# Altium project UART Converter use MCP2200.PrjPcb
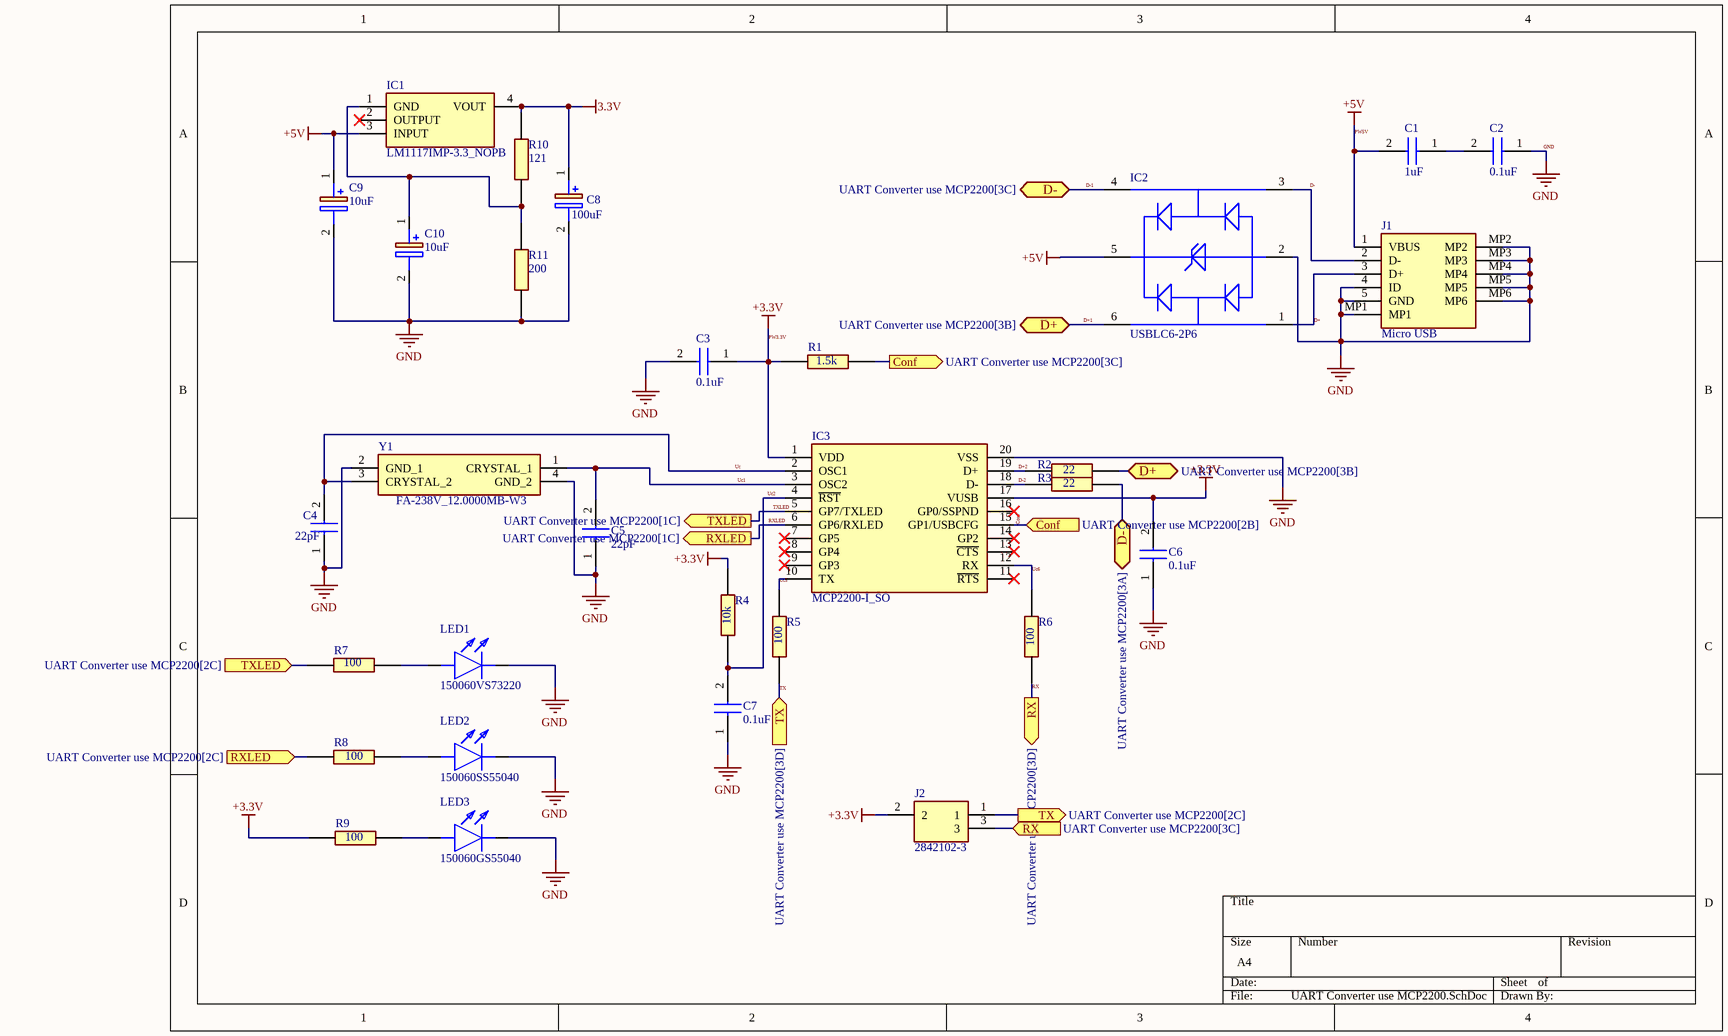
[diagram p0: UART Converter use MCP2200.SchDoc]
1 sheet, 30 parts. Net scope: flat (ports and power ports of the same name join across sheets).
Board file: UART Converter use MCP2200.PcbDoc

## Sheet UART Converter use MCP2200.SchDoc: UART Converter use MCP2200
size A4; ApprovedBy: Ing.IsmelArab; CheckedBy: Ing.IsmelArab; Author: Ing.IsmelArab; CompanyName: InGnia; Engineer: IsmelArab; Revision: Rev1.0; SheetNumber: 1; SheetTotal: 1

### Parts
C1  1uF  [CAPC3216X100N]
C2  0.1uF  [CAPC3216X100N]
C3  0.1uF  [CAPC3216X100N]
C4  22pF  [CAPC3216X100N]
C5  22pF  [CAPC3216X100N]
C6  0.1uF  [CAPC3216X100N]
C7  0.1uF  [CAPC3216X100N]
C8  100uF  [EEE1AA220WR]
C9  10uF  [EEE1AA220WR]
C10  10uF  [EEE1AA220WR]
IC1  LM1117IMP-3.3_NOPB  [SOT229P700X180-4N]
IC2  USBLC6-2P6  [USBLC62P6]
IC3  MCP2200-I_SO  [SOIC127P1030X265-20N]
J1  Micro USB  [0473461001]
J2  2842102-3  [28421023]
LED1  150060VS73220  [150060SS55040]
LED2  150060SS55040  [LEDC1608X50N]
LED3  150060GS55040  [LEDC1608X50N]
R1  1.5k  [RESC1608X55N]
R2  22  [RESC1608X55N]
R3  22  [RESC1608X55N]
R4  10k  [RESC1608X55N]
R5  100  [RESC1608X55N]
R6  100  [RESC1608X55N]
R7  100  [RESC1608X55N]
R8  100  [RESC1608X55N]
R9  100  [RESC1608X55N]
R10  121  [RESC1608X55N]
R11  200  [RESC1608X55N]
Y1  FA-238V_12.0000MB-W3  [FA-238V]

### Ports
Conf (in, see UART Converter use MCP2200[2B]), Conf (out, see UART Converter use MCP2200[3C]), D+ (bidir, see UART Converter use MCP2200[3B]), D- (bidir, see UART Converter use MCP2200[3A]), D- (bidir, see UART Converter use MCP2200[3C]), RX (in, see UART Converter use MCP2200[3C]), RX (out, see UART Converter use MCP2200[3D]), RXLED (in, see UART Converter use MCP2200[2C]), RXLED (out, see UART Converter use MCP2200[1C]), TX (in, see UART Converter use MCP2200[3D]), TX (out, see UART Converter use MCP2200[2C]), TXLED (in, see UART Converter use MCP2200[2C]), TXLED (out, see UART Converter use MCP2200[1C])

### Nets
3.3V: C8.1(+) IC1.4(VOUT) R10.1
GND: C2.1 C3.2 C4.1 C5.1 C6.1 C7.1 C8.2(-) C9.2(-) C10.2(-) IC2.2(GND) IC3.20(VSS) J1.4(ID) J1.5(GND) J1.MP1 J1.MP2 J1.MP3 J1.MP4 J1.MP5 J1.MP6 LED1.1(K) LED2.1(K) LED3.1(K) R11.2 Y1.2(GND_1) Y1.4(GND_2)
PW3.3V: C3.1 C6.2 IC3.1(VDD) IC3.17(VUSB) J2.2 R1.2 R4.2 R9.1  [also labelled +3.3V]
PW5V: C1.2 C9.1(+) IC1.3(INPUT) IC2.5(VBUS) J1.1(VBUS)  [also labelled +5V]
Conf: IC3.15(GP1/USBCFG) R1.1 ; port Conf
D+: IC2.1(I/O1_1) J1.3(D+)
D+1: IC2.6(I/O1_2) R2.1 ; port D+
D+2: IC3.19(D+) R2.2
D-: IC2.3(I/O2_1) J1.2(D-)
D-1: IC2.4(I/O2_2) R3.1 ; port D-
D-2: IC3.18(D-) R3.2
RX: J2.3 R6.1 ; port RX
RXLED: IC3.6(GP6/RXLED) R8.1 ; port RXLED
TX: J2.1 R5.1 ; port TX
TXLED: IC3.5(GP7/TXLED) R7.1 ; port TXLED
Uc: C4.2 IC3.2(OSC1) Y1.3(CRYSTAL_2)
Uc1: C5.2 IC3.3(OSC2) Y1.1(CRYSTAL_1)
Uc2: C7.2 IC3.4(~{RST}) R4.1
Uc5: IC3.10(TX) R5.2
Uc6: IC3.12(RX) R6.2
NetC1_1: C1.1 C2.2
NetC10_1: C10.1(+) IC1.1(GND) R10.2 R11.1
NetLED1_2: LED1.2(A) R7.2
NetLED2_2: LED2.2(A) R8.2
NetLED3_2: LED3.2(A) R9.2

Not connected (* = marked no-connect by the designer): IC1 2(OUTPUT)*; IC3 7(GP5)* 8(GP4)* 9(GP3)* 11(~{RTS})* 13(~{CTS})* 14(GP2)* 16(GP0/SSPND)*

### Library data of the parts
C1-C7 = CL31C220JBCNNNC: Capacitor; Manufacturer_Name: SAMSUNG; Datasheet Link: http://product.samsungsem.com/mlcc/CL31C220JBCNNN.do; Height: 1mm; Manufacturer_Part_Number: CL31C220JBCNNNC; Mouser Part Number: 187-CL31C220JBCNNNC; Mouser Price/Stock: https://www.mouser.co.uk/ProductDetail/Samsung-Electro-Mechanics/CL31C220JBCNNNC?qs=349EhDEZ59op%2FLhphPFLcA%3D%3D; Arrow Part Number: CL31C220JBCNNNC; Arrow Price/Stock: https://www.arrow.com/en/products/cl31c220jbcnnnc/samsung-electro-mechanics?region=nac
C8-C10 = EEE1AA100NR: Capacitor Polarised; Manufacturer_Name: Panasonic; Datasheet Link: http://industrial.panasonic.com/cdbs/www-data/pdf/RDE0000/ABA0000C1145.pdf; Height: 5.5mm; Manufacturer_Part_Number: EEE1AA100NR
IC1 = LM1117IMP-3.3_NOPB: Integrated Circuit; Manufacturer_Name: Texas Instruments; Manufacturer_Part_Number: LM1117IMP-3.3/NOPB; Datasheet Link: https://www.ti.com/lit/ds/symlink/lm1117.pdf?ts=1607578196475&ref_url=https%253A%252F%252Fwww.google.com%252F; Height: 1.8mm; Mouser Part Number: 926-LM1117IMP3.3NOPB; Mouser Price/Stock: https://www.mouser.co.uk/ProductDetail/Texas-Instruments/LM1117IMP-3.3-NOPB?qs=X1J7HmVL2ZFbpN1TgOsjYQ%3D%3D; Arrow Part Number: LM1117IMP-3.3/NOPB; Arrow Price/Stock: https://www.arrow.com/en/products/lm1117imp-3.3nopb/texas-instruments?utm_currency=USD&region=nac
IC2 = USBLC6-2P6: Integrated Circuit; Manufacturer_Name: STMicroelectronics; Datasheet Link: https://datasheet.lcsc.com/szlcsc/STMicroelectronics-USBLC6-2P6_C15999.pdf; Height: 0.6mm; Manufacturer_Part_Number: USBLC6-2P6; Mouser Part Number: 511-USBLC6-2P6; Mouser Price/Stock: https://www.mouser.co.uk/ProductDetail/STMicroelectronics/USBLC6-2P6?qs=6ARB0lp6jlViGcbUSvj1Mw%3D%3D; Arrow Part Number: USBLC6-2P6; Arrow Price/Stock: https://www.arrow.com/en/products/usblc6-2p6/stmicroelectronics?utm_currency=USD&region=nac
IC3 = MCP2200-I_SO: Integrated Circuit; Manufacturer_Name: Microchip; Manufacturer_Part_Number: MCP2200-I/SO; Datasheet Link: https://datasheet.datasheetarchive.com/originals/distributors/Datasheets-DGA2/214544.pdf; Height: 2.65mm; Mouser Part Number: 579-MCP2200-I/SO; Mouser Price/Stock: https://www.mouser.co.uk/ProductDetail/Microchip-Technology/MCP2200-I-SO?qs=kI7nsUnms46fN8L9VZlJCA%3D%3D; Arrow Part Number: MCP2200-I/SO; Arrow Price/Stock: https://www.arrow.com/en/products/mcp2200-iso/microchip-technology?region=nac
J1 = 0473461001: Connector; Manufacturer_Name: Molex; Datasheet Link: https://componentsearchengine.com/Datasheets/1/0473461001.pdf; Height: 2.45mm; Manufacturer_Part_Number: 0473461001; Mouser Part Number: N/A; Mouser Price/Stock: https://www.mouser.co.uk/ProductDetail/Molex/0473461001?qs=2bnkQPT%252BPafTZgGVt%2FOGfA%3D%3D; Arrow Part Number: 0473461001; Arrow Price/Stock: https://www.arrow.com/en/products/0473461001/molex?region=nac
J2 = 2842102-3: Connector; Manufacturer_Name: TE Connectivity; Datasheet Link: https://componentsearchengine.com/Datasheets/2/2842102-3.pdf; Height: 7.85mm; Manufacturer_Part_Number: 2842102-3; Mouser Part Number: 571-2842102-3; Mouser Price/Stock: https://www.mouser.co.uk/ProductDetail/TE-Connectivity/2842102-3?qs=Cb2nCFKsA8rGL40bBL%2F7Zw%3D%3D; Arrow Part Number: 2842102-3; Arrow Price/Stock: null?region=nac
LED1 = 150060VS73220: LED; Manufacturer_Name: Wurth Elektronik; Datasheet Link: https://componentsearchengine.com/Datasheets/2/150060VS73220.pdf; Manufacturer_Part_Number: 150060VS73220; Mouser Part Number: 710-150060VS73220; Mouser Price/Stock: https://www.mouser.co.uk/ProductDetail/Wurth-Elektronik/150060VS73220?qs=8Aam6%252B7C6HEF3HOqTkc72A%3D%3D
LED2 = 150060SS55040: LED; Manufacturer_Name: Wurth Elektronik; Datasheet Link: https://www.mouser.com/datasheet/2/445/150060SS55040-1714139.pdf; Manufacturer_Part_Number: 150060SS55040; Mouser Part Number: 710-150060SS55040; Mouser Price/Stock: https://www.mouser.co.uk/ProductDetail/Wurth-Elektronik/150060SS55040?qs=8Aam6%252B7C6HG0AGgMR5PhFg%3D%3D
LED3 = 150060GS55040: LED; Manufacturer_Name: Wurth Elektronik; Datasheet Link: https://katalog.we-online.de/led/datasheet/150060GS55040.pdf; Height: 0.5mm; Manufacturer_Part_Number: 150060GS55040; Mouser Part Number: 710-150060GS55040; Mouser Price/Stock: https://www.mouser.co.uk/ProductDetail/Wurth-Elektronik/150060GS55040?qs=fAHHVMwC%252Bbhr5Aln2oA6Nw%3D%3D
R1-R11 = ERJ-3EKF1001V: Resistor; Manufacturer_Name: Panasonic; Datasheet Link: http://industrial.panasonic.com/cdbs/www-data/pdf/RDA0000/AOA0000C86.pdf; Height: 0.55mm; Manufacturer_Part_Number: ERJ-3EKF1001V; Mouser Part Number: 667-ERJ-3EKF1001V; Mouser Price/Stock: https://www.mouser.co.uk/ProductDetail/Panasonic/ERJ-3EKF1001V?qs=H7k1u0Mp9JTM8yQxOuvoDg%3D%3D; Arrow Part Number: ERJ-3EKF1001V; Arrow Price/Stock: https://www.arrow.com/en/products/erj-3ekf1001v/panasonic?region=nac
Y1 = FA-238V_12.0000MB-W3: Crystal or Oscillator; Manufacturer_Name: Epson Timing; Manufacturer_Part_Number: FA-238V 12.0000MB-W3; Datasheet Link: https://www.digikey.ph/en/products/detail/epson/FA-238V-12-0000MB-W3/2403375?s=N4IgTCBcDaIGIEEC0YDMAOAagAgIxgDoAGEogWQCEkB1VEAXQF8g; Mouser Part Number: 732-FA-238V12MB-W3; Mouser Price/Stock: https://www.mouser.co.uk/ProductDetail/Epson-Timing/FA-238V-12.0000MB-W3?qs=HV%2FSjD3ivR9sYuOPaMueQA%3D%3D; Arrow Part Number: FA-238V 12.0000MB-W3; Arrow Price/Stock: https://www.arrow.com/en/products/fa-238v12.0000mb-w3/epson-electronics-america?region=nac